# Altium schematic sheet 42.SchDoc
size 513 x 386 mm
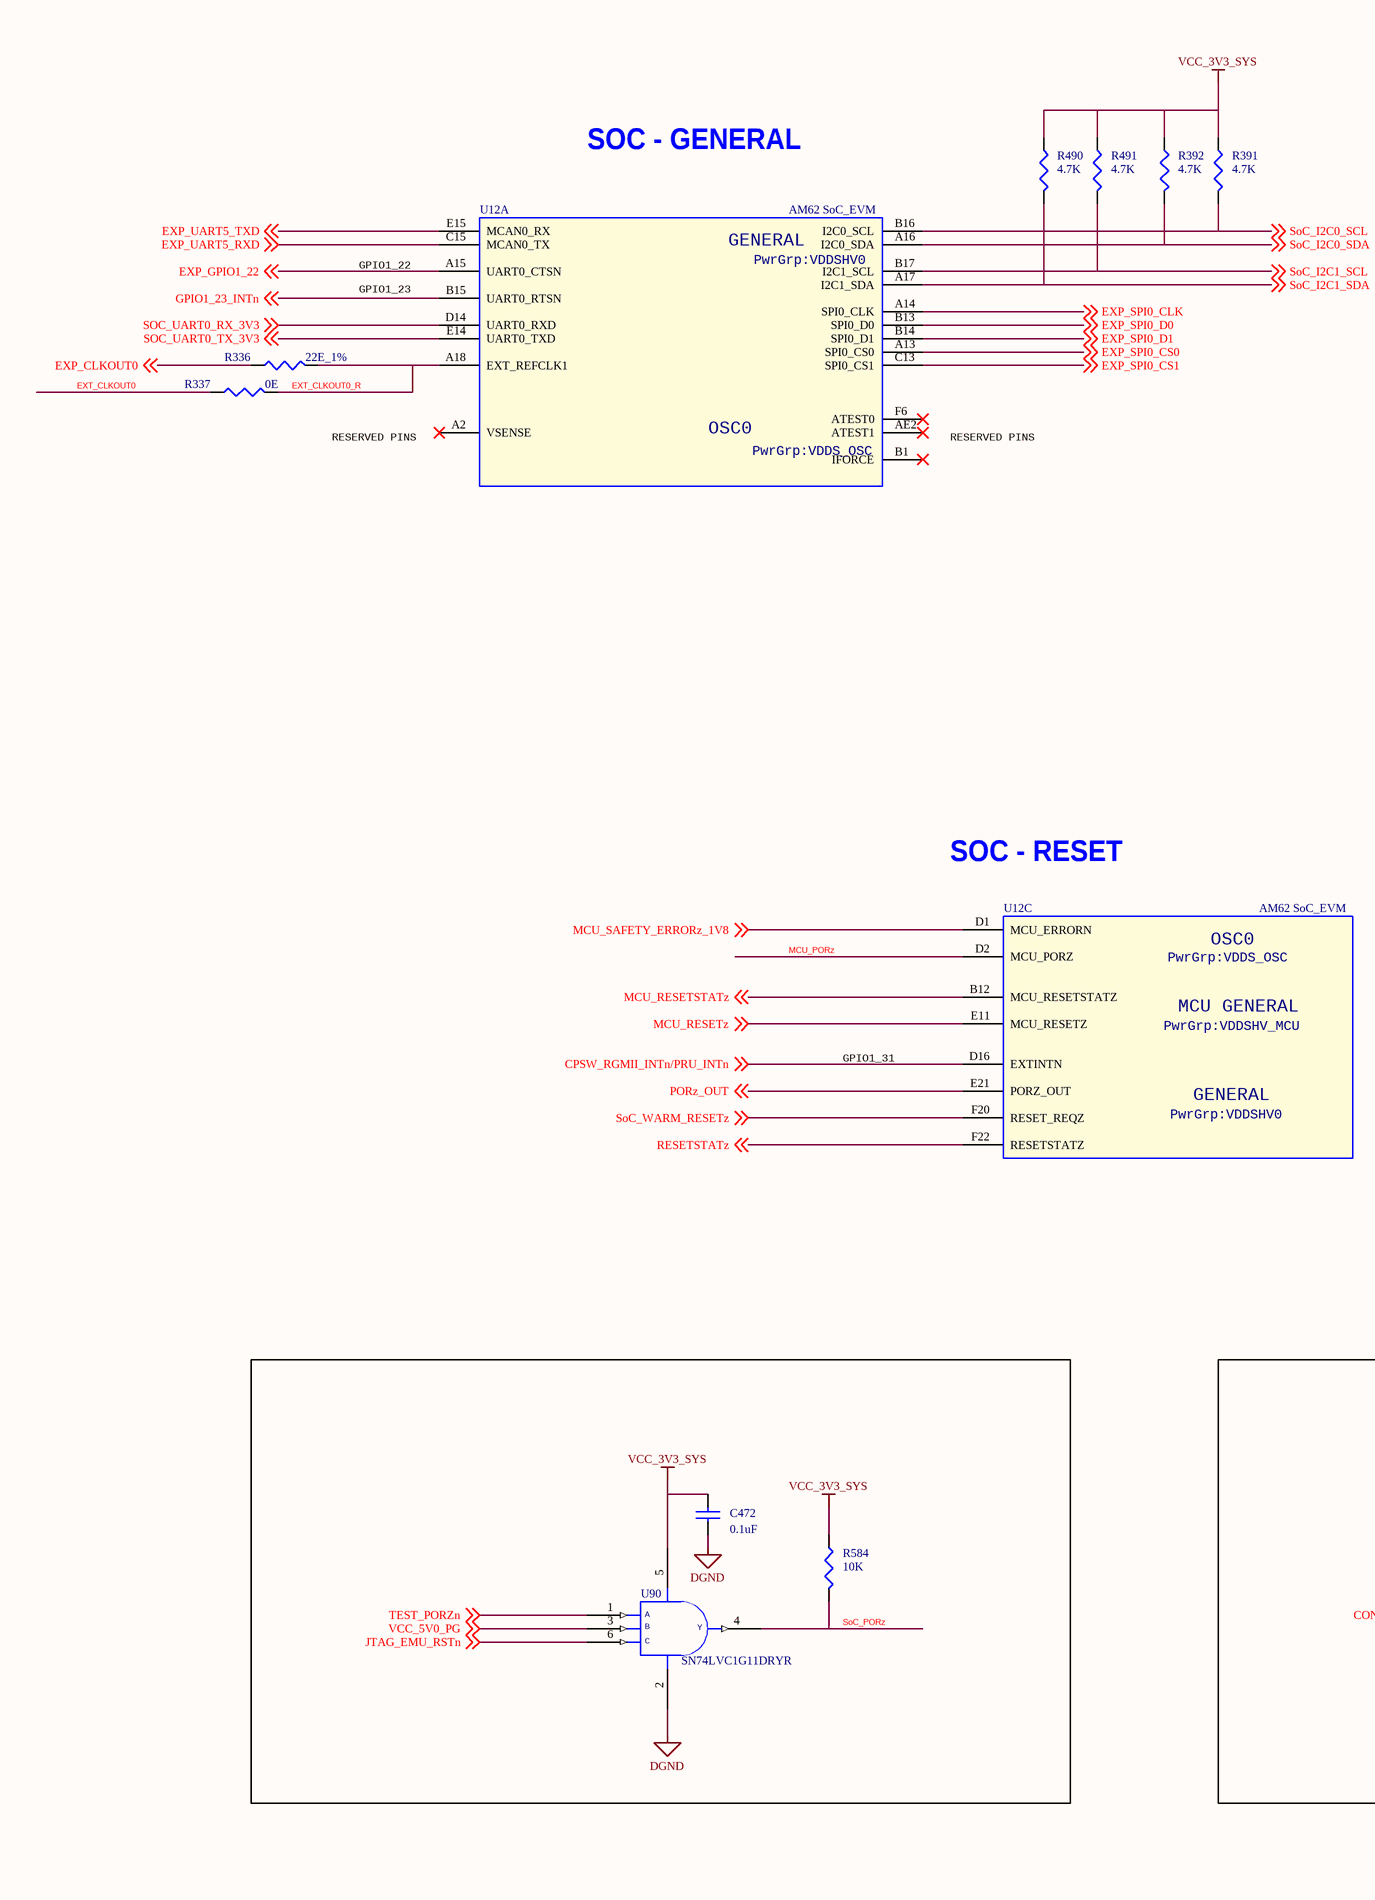
[diagram p0: 42.SchDoc, left]
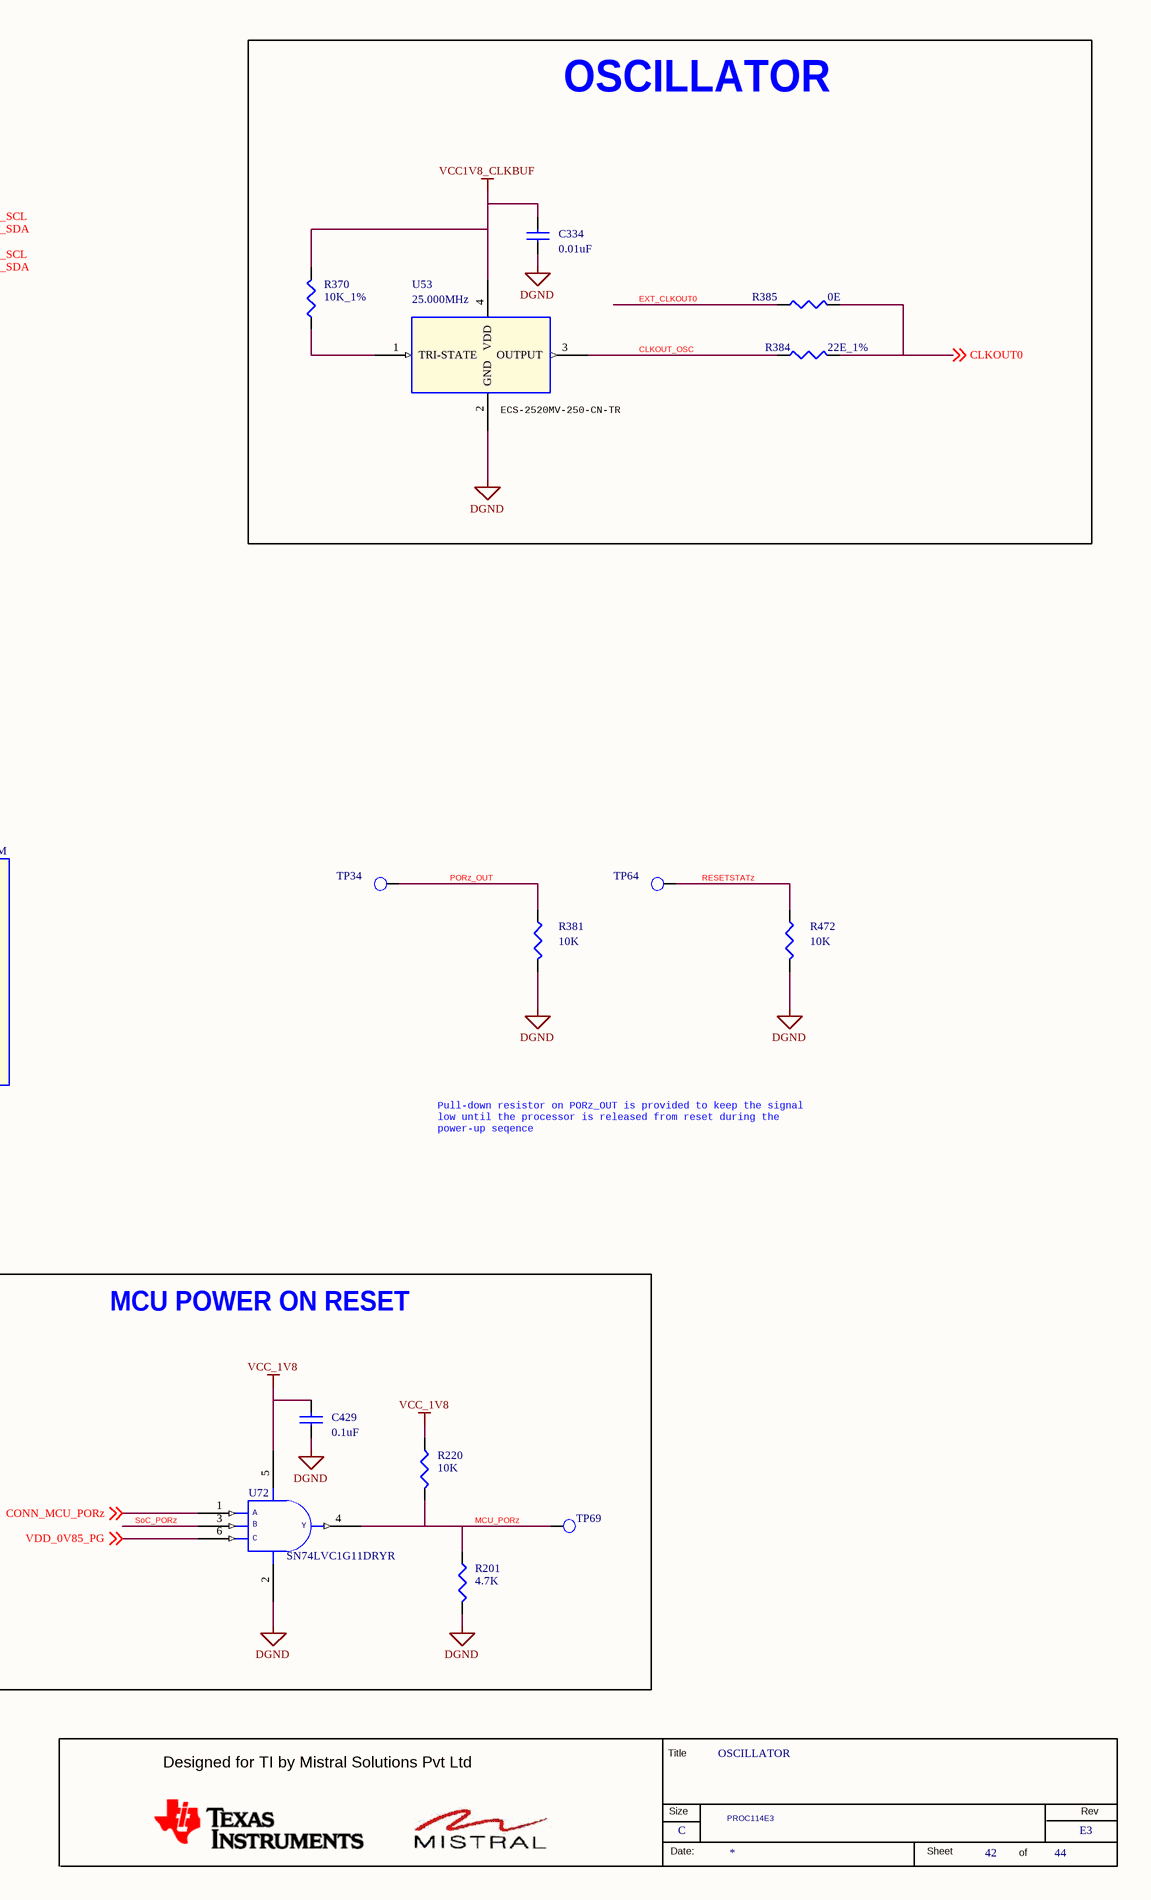
[diagram p1: 42.SchDoc, right]

## Parts
*  RevCode: E3  Title: OSCILLATOR  Page Size: C  Page Number: 42  Page Count: 44  Variant Name: PROC114E3  (hidden comment: MISTRAL_TITLEBLK_CSIZE)  (graphical)
C334  0.01uF  [CAP0201_0-5]
C429  0.1uF  [CAP0201_0-5]
C472  0.1uF  [CAP0201_0-5]
R201  4.7K  [RES0201_0-5]
R220  10K  [RES0201_0-5]
R336  22E_1%  [RES0201_0-5]
R337  0E  [RES0201_0-5]
R370  10K_1%  [RES0201_0-5]
R381  10K  [RES0201_0-5]
R384  22E_1%  [RES0201_0-5]
R385  0E  [RES0201_0-5]
R391  4.7K  [RES0201_0-5]
R392  4.7K  [RES0201_0-5]
R472  10K  [RES0201_0-5]
R490  4.7K  [RES0201_0-5]
R491  4.7K  [RES0201_0-5]
R584  10K  [RES0201_0-5]
TP34  TP20_SMD  [TP20_SMD]  (value not drawn)
TP64  TP20_SMD  [TP20_SMD]  (value not drawn)
TP69  TP20_SMD  [TP20_SMD]  (value not drawn)
U12  AM62 SoC_EVM  [BGA425_19-68_510X510_0-7]  (parts A,C of 18)
U53  25.000MHz  [OSC4_ECS-2520MV_100X80_SMD_0-9]
U72  SN74LVC1G11DRYR  [SON6_SN74LVC2G17_40X60_0-6]
U90  SN74LVC1G11DRYR  [SON6_SN74LVC2G17_40X60_0-6]

## Blocks framed on the sheet
OSCILLATOR: C334 R370 R384 R385 U53
MCU POWER ON RESET: C429 R201 R220 TP69 U72

## Nets
DGND: C334.1 C429.1 C472.1 R201.2 R381.2 R472.2 U53.2(GND) U72.2(GND) U90.2(GND)
VCC1V8_CLKBUF: C334.2 R370.2 U53.4(VDD)
VCC_1V8: C429.2 R220.1 U72.5(VCC)
VCC_3V3_SYS: C472.2 R391.1 R392.1 R490.1 R491.1 R584.1 U90.5(VCC)
CLKOUT0: R384.2 R385.2 ; off-sheet CLKOUT0
CLKOUT_OSC: R384.1 U53.3(OUTPUT)
CONN_MCU_PORz: U72.1(A) ; off-sheet CONN_MCU_PORz
CPSW_RGMII_INTn/PRU_INTn: U12.D16(EXTINTN) ; off-sheet CPSW_RGMII_INTn/PRU_INTn
EXP_CLKOUT0: R336.1 ; off-sheet EXP_CLKOUT0
EXP_GPIO1_22: U12.A15(UART0_CTSN) ; off-sheet EXP_GPIO1_22
EXP_SPI0_CLK: U12.A14(SPI0_CLK) ; off-sheet EXP_SPI0_CLK
EXP_SPI0_CS0: U12.A13(SPI0_CS0) ; off-sheet EXP_SPI0_CS0
EXP_SPI0_CS1: U12.C13(SPI0_CS1) ; off-sheet EXP_SPI0_CS1
EXP_SPI0_D0: U12.B13(SPI0_D0) ; off-sheet EXP_SPI0_D0
EXP_SPI0_D1: U12.B14(SPI0_D1) ; off-sheet EXP_SPI0_D1
EXP_UART5_RXD: U12.C15(MCAN0_TX) ; off-sheet EXP_UART5_RXD
EXP_UART5_TXD: U12.E15(MCAN0_RX) ; off-sheet EXP_UART5_TXD
EXT_CLKOUT0: R337.1 R385.1
EXT_CLKOUT0_R: R336.2 R337.2 U12.A18(EXT_REFCLK1)
GPIO1_23_INTn: U12.B15(UART0_RTSN) ; off-sheet GPIO1_23_INTn
JTAG_EMU_RSTn: U90.6(C) ; off-sheet JTAG_EMU_RSTn
MCU_PORz: R201.1 R220.2 TP69.1(TP) U12.D2(MCU_PORZ) U72.4(Y)
MCU_RESETSTATz: U12.B12(MCU_RESETSTATZ) ; off-sheet MCU_RESETSTATz
MCU_RESETz: U12.E11(MCU_RESETZ) ; off-sheet MCU_RESETz
MCU_SAFETY_ERRORz_1V8: U12.D1(MCU_ERRORN) ; off-sheet MCU_SAFETY_ERRORz_1V8
PORz_OUT: R381.1 TP34.1(TP) U12.E21(PORZ_OUT) ; off-sheet PORz_OUT
RESETSTATz: R472.1 TP64.1(TP) U12.F22(RESETSTATZ) ; off-sheet RESETSTATz
SoC_I2C0_SCL: R391.2 U12.B16(I2C0_SCL) ; off-sheet SoC_I2C0_SCL
SoC_I2C0_SDA: R392.2 U12.A16(I2C0_SDA) ; off-sheet SoC_I2C0_SDA
SoC_I2C1_SCL: R491.2 U12.B17(I2C1_SCL) ; off-sheet SoC_I2C1_SCL
SoC_I2C1_SDA: R490.2 U12.A17(I2C1_SDA) ; off-sheet SoC_I2C1_SDA
SoC_PORz: R584.2 U72.3(B) U90.4(Y)
SOC_UART0_RX_3V3: U12.D14(UART0_RXD) ; off-sheet SOC_UART0_RX_3V3
SOC_UART0_TX_3V3: U12.E14(UART0_TXD) ; off-sheet SOC_UART0_TX_3V3
SoC_WARM_RESETz: U12.F20(RESET_REQZ) ; off-sheet SoC_WARM_RESETz
TEST_PORZn: U90.1(A) ; off-sheet TEST_PORZn
VCC_5V0_PG: U90.3(B) ; off-sheet VCC_5V0_PG
VDD_0V85_PG: U72.6(C) ; off-sheet VDD_0V85_PG
NetR370_1: R370.1 U53.1(TRI-STATE)

Not connected (* = marked no-connect by the designer): U12 A2(VSENSE)* AE2(ATEST1)* B1(IFORCE)* F6(ATEST0)*

## Notes on the sheet
- SOC - GENERAL
- GPIO1_22
- GPIO1_23
- RESERVED PINS
- (near U53) ECS-2520MV-250-CN-TR
- SOC - RESET
- GPIO1_31
- Pull-down resistor on PORz_OUT is provided to keep the signal
  low until the processor is released from reset during the
  power-up seqence
- (in symbol AM62-EVM_BGA425, part A) GENERAL; PwrGrp:VDDSHV0; OSC0; PwrGrp:VDDS_OSC
- (in symbol AM62-EVM_BGA425, part C) OSC0; PwrGrp:VDDS_OSC; MCU GENERAL; PwrGrp:VDDSHV_MCU; GENERAL; PwrGrp:VDDSHV0
- (in symbol MISTRAL_TITLEBLK_CSIZE) Title; Designed for TI by Mistral Solutions Pvt Ltd; Size; Rev; Date:; Sheet; of

## Library data of the parts
* = MISTRAL_TITLEBLK_CSIZE: Issue: 1.0; Page Create Date: March  8, 1995; Page Modify Date: *; Schematic Page Count: 44; Schematic Page Number: 42
C334 = CAP_Dup2: CAP CERAMIC 0.01uF 25V 10% X5R 0201; Mistral Part No: 120018010007-R; Mfr_name: MURATA; Mfr_part_number: GRM033R61E103KA12J; Part_type: CAPACITORS\CERAMIC; Wattage: NA; Project: TI_MAXIE_CPB; Customs_HS_Code: 85322990; Custom_Duty: 15%; Footprint Path: Y:\MIS_DATABASE\Library\ALTIUM_TOOL\PCB_FOOTPRINTS\Altium_Footprint_Lib.PcbLib; Library Path: Y:\MIS_DATABASE\Library\ALTIUM_TOOL\SCHEMATICS_PARTS\MS_DISCRETE_Library.schlib; Footprint Ref: CAP0201_0-5; MECHANICAL 3D STEP FILE: CAP0201_0-5; Temperature: -55°C+85°C; Weight: 0.33mg; Tolerance: 10%; Voltage: 25V; Package: 0201; Distributor_name: DIGIKEY; Distributor_part_number: GRM033R61E103KA12J-ND; Height: 0.33MM; Datasheet: Y:\MIS_DATABASE\DATASHEETS\CAPACITORS\GRM033R61E103KA12.PDF; Crtd /date: MANIRAJA/230118; Chkd/date: MANIRAJA/230118; Library Ref: CAP; PCB Footprint: CAP0201_0-5
C429 = CAP_Dup2: CAP CERAMIC 0.1uF 16V 10% X5R 0201; Alt_Mfr_name: YAGEO AMERICA; Part_type: CAPACITORS\CERAMIC; Mfr_part_number: GRM033R61C104KE14D; Mfr_name: MURATA; Mistral Part No: 120009030072-R; Alt_Mfr_part_number: CC0402KRX5R8BB104; Custom_Duty: 15%; Customs_HS_Code: 85322990; Wattage: NA; Project: TI_MAXIE_CPB; PCB Footprint: CAP0201_0-5; Footprint Path: Y:\MIS_DATABASE\Library\ALTIUM_TOOL\PCB_FOOTPRINTS\Altium_Footprint_Lib.PcbLib; Library Path: Y:\MIS_DATABASE\Library\ALTIUM_TOOL\SCHEMATICS_PARTS\MS_DISCRETE_Library.schlib; Footprint Ref: CAP0201_0-5; Library Ref: CAP; MECHANICAL 3D STEP FILE: CAP0201_0-5; Chkd/date: MANIRAJA/230118; Crtd /date: MANIRAJA/230118; Datasheet: Y:\MIS_DATABASE\DATASHEETS\CAPACITORS\GRM033R61C104KE14.PDF; Temperature: -55°C+85°C; Weight: 0.33mg; Height: 0.33MM; Distributor_part_number: 490-14305-1-ND; Distributor_name: DIGIKEY; Package: 0201; Voltage: 16V; Tolerance: 10%
C472 = CAP_Dup2: CAP CERAMIC 0.1uF 16V 10% X5R 0201; Alt_Mfr_part_number: CC0402KRX5R8BB104; Mistral Part No: 120009030072-R; Mfr_name: MURATA; Mfr_part_number: GRM033R61C104KE14D; Part_type: CAPACITORS\CERAMIC; Alt_Mfr_name: YAGEO AMERICA; Project: TI_MAXIE_CPB; Wattage: NA; Customs_HS_Code: 85322990; Custom_Duty: 15%; PCB Footprint: CAP0201_0-5; Tolerance: 10%; Voltage: 16V; Package: 0201; Distributor_name: DIGIKEY; Distributor_part_number: 490-14305-1-ND; Height: 0.33MM; Weight: 0.33mg; Temperature: -55°C+85°C; Datasheet: Y:\MIS_DATABASE\DATASHEETS\CAPACITORS\GRM033R61C104KE14.PDF; Crtd /date: MANIRAJA/230118; Chkd/date: MANIRAJA/230118; MECHANICAL 3D STEP FILE: CAP0201_0-5; Library Ref: CAP; Footprint Ref: CAP0201_0-5; Library Path: Y:\MIS_DATABASE\Library\ALTIUM_TOOL\SCHEMATICS_PARTS\MS_DISCRETE_Library.schlib; Footprint Path: Y:\MIS_DATABASE\Library\ALTIUM_TOOL\PCB_FOOTPRINTS\Altium_Footprint_Lib.PcbLib
R201 R391 = RESISTOR_Dup6: RES 4.7K 1/20W 5% 0201; Mistral Part No: 110021090007-R; Mfr_name: YAGEO AMERICA; Mfr_part_number: RC0201JR-074K7L; Part_type: RESISTORS\FIXED; Project: TI_AM62x SKEVM_BRD; Voltage: NA; Customs_HS_Code: 85332119; Custom_Duty: 15%; PCB Footprint: RES0201_0-5; Footprint Ref: RES0201_0-5; Tolerance: 5%; Wattage: 1/20W; Package: 0201; Distributor_name: DIGIKEY; Distributor_part_number: 311-4.7KNCT-ND; Library Ref: RESISTOR; Height: 0.26MM; Weight: 0.17mg; Temperature: -55°C+125°C; Datasheet: Y:\MIS_DATABASE\DATASHEETS\RESISTORS\RCXXXXL-SER_MAR18.PDF; Crtd /date: ALVY/200921; Chkd/date: MANIRAJA/200921; MECHANICAL 3D STEP FILE: RES0201_0-5; Library Path: Y:\MIS_DATABASE\Library\ALTIUM_TOOL\SCHEMATICS_PARTS\MS_DISCRETE_Library.schlib; Footprint Path: Y:\MIS_DATABASE\Library\ALTIUM_TOOL\PCB_FOOTPRINTS\Altium_Footprint_Lib.PcbLib
R220 R381 = RESISTOR_Dup6: RES 10K 1/20W 5% 0201; Part_type: RESISTORS\FIXED; Mfr_part_number: RC0201JR-0710KL; Mfr_name: YAGEO AMERICA; Mistral Part No: 110010070051-R; Custom_Duty: 15%; Customs_HS_Code: 85332119; Voltage: NA; Project: GOLDEN-I LITE; MECHANICAL 3D STEP FILE: RES0201_0-5; Chkd/date: MANIRAJA/050517; Crtd /date: MANIRAJA/050517; Datasheet: Y:\MIS_DATABASE\DATASHEETS\RESISTORS\RCXXXXL-SER_MAR18.PDF; Temperature: -55°C+125°C; Weight: 0.17mg; Height: 0.26MM; Distributor_part_number: 311-10KNCT-ND; Distributor_name: DIGIKEY; Package: 0201; Wattage: 1/20W; Tolerance: 5%; Library Ref: RESISTOR; Footprint Ref: RES0201_0-5; Library Path: Y:\MIS_DATABASE\Library\ALTIUM_TOOL\SCHEMATICS_PARTS\MS_DISCRETE_Library.schlib; Footprint Path: Y:\MIS_DATABASE\Library\ALTIUM_TOOL\PCB_FOOTPRINTS\Altium_Footprint_Lib.PcbLib; PCB Footprint: RES0201_0-5
R336 R384 = RESISTOR_Dup1: RES 22E 1/20W 1% 0201; Mistral Part No: 110009030522-R; Mfr_name: YAGEO AMERICA; Mfr_part_number: RC0201FR-0722RL; Part_type: RESISTORS\FIXED; Project: AM654x_SOM; Voltage: NA; Customs_HS_Code: 85332119; Custom_Duty: 15%; Footprint Ref: RES0201_0-5; Tolerance: 1%; Wattage: 1/20W; Package: 0201; Distributor_name: DIGIKEY; Distributor_part_number: YAG2518CT-ND; Library Ref: RESISTOR; Height: 0.26MM; Weight: 0.17mg; Temperature: -55°C+125°C; Datasheet: Y:\MIS_DATABASE\DATASHEETS\RESISTORS\RCXXXXL-SER_MAR18.PDF; Crtd /date: ALVY/080319; Chkd/date: MANIRAJA/080319; MECHANICAL 3D STEP FILE: RES0201_0-5; Library Path: Y:\MIS_DATABASE\Library\ALTIUM_TOOL\SCHEMATICS_PARTS\MS_DISCRETE_Library.schlib; Footprint Path: Y:\MIS_DATABASE\Library\ALTIUM_TOOL\PCB_FOOTPRINTS\Altium_Footprint_Lib.PcbLib; PCB Footprint: RES0201_0-5
R337 R385 = RESISTOR_Dup4: RES 0E 1/20W 5% 0201; Mistral Part No: 110010070067-R; Mfr_name: YAGEO AMERICA; Mfr_part_number: RC0201JR-070RL; Part_type: RESISTORS\FIXED; Project: PB_BUGBASE; Voltage: NA; Customs_HS_Code: 85332119; Custom_Duty: 15%; PCB Footprint: RES0201_0-5; MECHANICAL 3D STEP FILE: RES0201_0-5; Tolerance: 5%; Wattage: 1/20W; Package: 0201; Distributor_name: DIGIKEY; Distributor_part_number: 311-0.0NCT-ND; Height: 0.26MM; Weight: 0.17mg; Temperature: -55°C+125°C; Datasheet: Y:\MIS_DATABASE\DATASHEETS\RESISTORS\RCXXXXL-SER_MAR18.PDF; Crtd /date: MUDDU/120710; Chkd/date: NAVEED/301214; Library Ref: RESISTOR; Footprint Ref: RES0201_0-5; Library Path: Y:\MIS_DATABASE\Library\ALTIUM_TOOL\SCHEMATICS_PARTS\MS_DISCRETE_Library.schlib; Footprint Path: Y:\MIS_DATABASE\Library\ALTIUM_TOOL\PCB_FOOTPRINTS\Altium_Footprint_Lib.PcbLib
R370 = RESISTOR_Dup4: RES 10K 1/20W 1% 0201; Part_type: RESISTORS\FIXED; Mfr_part_number: RC0201FR-0710KL; Mfr_name: YAGEO AMERICA; Mistral Part No: 110011040018-R; Custom_Duty: 15%; Customs_HS_Code: 85332119; Voltage: NA; Project: GOLDEN-I LITE; Footprint Path: Y:\MIS_DATABASE\Library\ALTIUM_TOOL\PCB_FOOTPRINTS\Altium_Footprint_Lib.PcbLib; Library Path: Y:\MIS_DATABASE\Library\ALTIUM_TOOL\SCHEMATICS_PARTS\MS_DISCRETE_Library.schlib; Footprint Ref: RES0201_0-5; Library Ref: RESISTOR; Chkd/date: VASANTHA/270117; Crtd /date: MANIRAJA/270117; Datasheet: Y:\MIS_DATABASE\DATASHEETS\RESISTORS\RCXXXXL-SER_MAR18.PDF; Temperature: -55°C+125°C; Weight: 0.17mg; Height: 0.26MM; Distributor_part_number: 311-10.0KMCT-ND; Distributor_name: DIGIKEY; Package: 0201; Wattage: 1/20W; Tolerance: 1%; MECHANICAL 3D STEP FILE: RES0201_0-5; PCB Footprint: RES0201_0-5
R392 R490 R491 = RESISTOR_Dup6: RES 4.7K 1/20W 5% 0201; Part_type: RESISTORS\FIXED; Mfr_part_number: RC0201JR-074K7L; Mfr_name: YAGEO AMERICA; Mistral Part No: 110021090007-R; Custom_Duty: 15%; Customs_HS_Code: 85332119; Voltage: NA; Project: TI_AM62x SKEVM_BRD; Footprint Path: Y:\MIS_DATABASE\Library\ALTIUM_TOOL\PCB_FOOTPRINTS\Altium_Footprint_Lib.PcbLib; Library Path: Y:\MIS_DATABASE\Library\ALTIUM_TOOL\SCHEMATICS_PARTS\MS_DISCRETE_Library.schlib; MECHANICAL 3D STEP FILE: RES0201_0-5; Chkd/date: MANIRAJA/200921; Crtd /date: ALVY/200921; Datasheet: Y:\MIS_DATABASE\DATASHEETS\RESISTORS\RCXXXXL-SER_MAR18.PDF; Temperature: -55°C+125°C; Weight: 0.17mg; Height: 0.26MM; Library Ref: RESISTOR; Distributor_part_number: 311-4.7KNCT-ND; Distributor_name: DIGIKEY; Package: 0201; Wattage: 1/20W; Tolerance: 5%; Footprint Ref: RES0201_0-5; PCB Footprint: RES0201_0-5
R472 R584 = RESISTOR_Dup6: RES 10K 1/20W 5% 0201; Mistral Part No: 110010070051-R; Mfr_name: YAGEO AMERICA; Mfr_part_number: RC0201JR-0710KL; Part_type: RESISTORS\FIXED; Project: GOLDEN-I LITE; Voltage: NA; Customs_HS_Code: 85332119; Custom_Duty: 15%; Footprint Path: Y:\MIS_DATABASE\Library\ALTIUM_TOOL\PCB_FOOTPRINTS\Altium_Footprint_Lib.PcbLib; Library Path: Y:\MIS_DATABASE\Library\ALTIUM_TOOL\SCHEMATICS_PARTS\MS_DISCRETE_Library.schlib; Footprint Ref: RES0201_0-5; Library Ref: RESISTOR; Tolerance: 5%; Wattage: 1/20W; Package: 0201; Distributor_name: DIGIKEY; Distributor_part_number: 311-10KNCT-ND; Height: 0.26MM; Weight: 0.17mg; Temperature: -55°C+125°C; Datasheet: Y:\MIS_DATABASE\DATASHEETS\RESISTORS\RCXXXXL-SER_MAR18.PDF; Crtd /date: MANIRAJA/050517; Chkd/date: MANIRAJA/050517; MECHANICAL 3D STEP FILE: RES0201_0-5; PCB Footprint: RES0201_0-5
TP34 TP69 = TESTPOINT: TESTPOINT CIR 20 SMD; Mfr_name: LOCAL; Custom_Duty: NA; Project: BT MODULE_CSRBC04; PCB Footprint: TP20_SMD; Customs_HS_Code: NA; RoHS: NA; Footprint Ref: TP20_SMD; Library Ref: TESTPOINT; Footprint Path: Y:\MIS_DATABASE\Library\ALTIUM_TOOL\PCB_FOOTPRINTS\Altium_Footprint_Lib.PcbLib; Library Path: Y:\MIS_DATABASE\Library\ALTIUM_TOOL\SCHEMATICS_PARTS\MS_DISCRETE_Library.schlib; MECHANICAL 3D STEP FILE: NA; Datasheet: NA; Temperature: NA; Weight: NA; Wattage: NA; Voltage: NA; Tolerance: NA; Chkd/date: SHREESHAIL/171006; Crtd /date: MAZHAR/171006; Height: NA; Distributor_part_number: NA; Distributor_name: NA; Package: SMD; Part_type: TESTPOINT; Mfr_part_number: TP20_SMD; Mistral Part No: NA
TP64 = TESTPOINT: TESTPOINT CIR 20 SMD; Mistral Part No: NA; Mfr_name: LOCAL; Project: BT MODULE_CSRBC04; PCB Footprint: TP20_SMD; Mfr_part_number: TP20_SMD; Part_type: TESTPOINT; Package: SMD; Distributor_name: NA; Distributor_part_number: NA; Height: NA; Crtd /date: MAZHAR/171006; Chkd/date: SHREESHAIL/171006; Tolerance: NA; Voltage: NA; Wattage: NA; Weight: NA; Temperature: NA; Datasheet: NA; MECHANICAL 3D STEP FILE: NA; Library Path: Y:\MIS_DATABASE\Library\ALTIUM_TOOL\SCHEMATICS_PARTS\MS_DISCRETE_Library.schlib; Footprint Path: Y:\MIS_DATABASE\Library\ALTIUM_TOOL\PCB_FOOTPRINTS\Altium_Footprint_Lib.PcbLib; Library Ref: TESTPOINT; Footprint Ref: TP20_SMD; RoHS: NA; Customs_HS_Code: NA; Custom_Duty: NA
U12 = AM62-EVM_BGA425: IC AM62 SoC MICROPROCESSOR BGA425; Part_type: ICS\DIGITAL\MICROPROCESSOR; Mfr_name: TEXAS INSTRUMENTS; Mistral Part No: 141221060001; Custom_Duty: 15%; Customs_HS_Code: 85423100; Wattage: NA; Project: AM62_EVM_BRD; Footprint Path: Y:\MIS_DATABASE\Library\ALTIUM_TOOL\PCB_FOOTPRINTS\Altium_Footprint_Lib.PcbLib; Library Path: Y:\MIS_DATABASE\Library\ALTIUM_TOOL\SCHEMATICS_PARTS\MS_MICROPROCESSOR_Library.schlib; MECHANICAL 3D STEP FILE: BGA425_19-68_510X510_0-7; RoHS: NA; Chkd/date: ALVY/110621; Crtd /date: MANIRAJA/110621; Datasheet: Y:\MIS_DATABASE\DATASHEETS\ICS\DIGITAL\MICROCONTROLLER\AM62-SoC_SVB.PDF; Temperature: NA; Weight: NA; Height: 0.65MM; Footprint Ref: BGA425_19-68_510X510_0-7; Library Ref: AM62-EVM_BGA425; Distributor_part_number: NA; Distributor_name: NA; Package: BGA425; Voltage: NA; Tolerance: NA; Mfr_part_number: AM62 SoC_EVM; PCB Footprint: BGA425_19-68_510X510_0-7
U53 = OSC4_ASFL3: OSC 25.000MHz CMOS SMD; Mistral Part No: 130020110041-R; Mfr_name: ECS INC; Mfr_part_number: ECS-2520MV-250-CN-TR; Part_type: OSCILLATORS; Project: AM64X_SKEVM; Tolerance: NA; Customs_HS_Code: 85437099; Custom_Duty: 24%; Voltage: NA; Wattage: NA; Package: SMD; Distributor_name: DIGIKEY; Distributor_part_number: XC2752CT-ND; Library Ref: OSC4_ASFL3; Footprint Ref: OSC4_ECS-2520MV_100X80_SMD_0-9; Height: 0.90MM; Weight: 311mg; Temperature: -40°C+85°C; Datasheet: Y:\MIS_DATABASE\DATASHEETS\MISC\CRY_OSC\ECS-2520MV.PDF; Crtd /date: ALVY/181120; Chkd/date: MANIRAJA/181120; MECHANICAL 3D STEP FILE: OSC4_ECS-2520MV_100X80_SMD_0-9; Library Path: Y:\MIS_DATABASE\Library\ALTIUM_TOOL\SCHEMATICS_PARTS\MS_DISCRETE_Library.schlib; Footprint Path: Y:\MIS_DATABASE\Library\ALTIUM_TOOL\PCB_FOOTPRINTS\Altium_Footprint_Lib.PcbLib; PCB Footprint: OSC4_ECS-2520MV_100X80_SMD_0-9
U72 = SN74LVC1G11DCKR_SC70-6: IC SINGLE 3-INPUT POSITIVE-AND GATE SON6; Mistral Part No: 141021010013-R; Mfr_name: TEXAS INSTRUMENTS; Part_type: ICS\DIGITAL\GATES; Project: AM64X_SKEVM; Tolerance: NA; Customs_HS_Code: 85423100; Custom_Duty: 15%; PCB Footprint: SON6_SN74LVC2G17_40X60_0-6; Footprint Ref: SON6_SN74LVC2G17_40X60_0-6; Mfr_part_number: SN74LVC1G11DRYR; Voltage: NA; Wattage: NA; Package: SON6; Distributor_name: DIGIKEY; Distributor_part_number: 296-30120-1-ND; Library Ref: SN74LVC1G11DCKR_SC70-6; Height: 0.60MM; Weight: 33mg; Temperature: -40°C+125°C; Datasheet: Y:\MIS_DATABASE\DATASHEETS\ICS\DIGITAL\GATES\SN74LVC1G_NOV16.PDF; Crtd /date: ALVY/270121; Chkd/date: MANIRAJA/270121; MECHANICAL 3D STEP FILE: SON6_SN74LVC2G17_40X60_0-6; Library Path: Y:\MIS_DATABASE\Library\ALTIUM_TOOL\SCHEMATICS_PARTS\MS_GATE_Library.schlib; Footprint Path: Y:\MIS_DATABASE\Library\ALTIUM_TOOL\PCB_FOOTPRINTS\Altium_Footprint_Lib.PcbLib
U90 = SN74LVC1G11DCKR_SC70-6: IC SINGLE 3-INPUT POSITIVE-AND GATE SON6; Part_type: ICS\DIGITAL\GATES; Mfr_name: TEXAS INSTRUMENTS; Mistral Part No: 141021010013-R; Custom_Duty: 15%; Customs_HS_Code: 85423100; Wattage: NA; Project: AM64X_SKEVM; Footprint Path: Y:\MIS_DATABASE\Library\ALTIUM_TOOL\PCB_FOOTPRINTS\Altium_Footprint_Lib.PcbLib; Library Path: Y:\MIS_DATABASE\Library\ALTIUM_TOOL\SCHEMATICS_PARTS\MS_GATE_Library.schlib; MECHANICAL 3D STEP FILE: SON6_SN74LVC2G17_40X60_0-6; Chkd/date: MANIRAJA/270121; Crtd /date: ALVY/270121; Datasheet: Y:\MIS_DATABASE\DATASHEETS\ICS\DIGITAL\GATES\SN74LVC1G_NOV16.PDF; Temperature: -40°C+125°C; Weight: 33mg; Height: 0.60MM; Library Ref: SN74LVC1G11DCKR_SC70-6; Distributor_part_number: 296-30120-1-ND; Distributor_name: DIGIKEY; Package: SON6; Voltage: NA; Tolerance: NA; Mfr_part_number: SN74LVC1G11DRYR; Footprint Ref: SON6_SN74LVC2G17_40X60_0-6; PCB Footprint: SON6_SN74LVC2G17_40X60_0-6